# Altium schematic sheet ESM-4G-V1.1.SchDoc: =projectname
size A3; Organization: KeoLac; Address1: SIMCO Building,; Address2: 28 -  Pham Hung,; Address3: Nam Tu Liem - Ha Noi
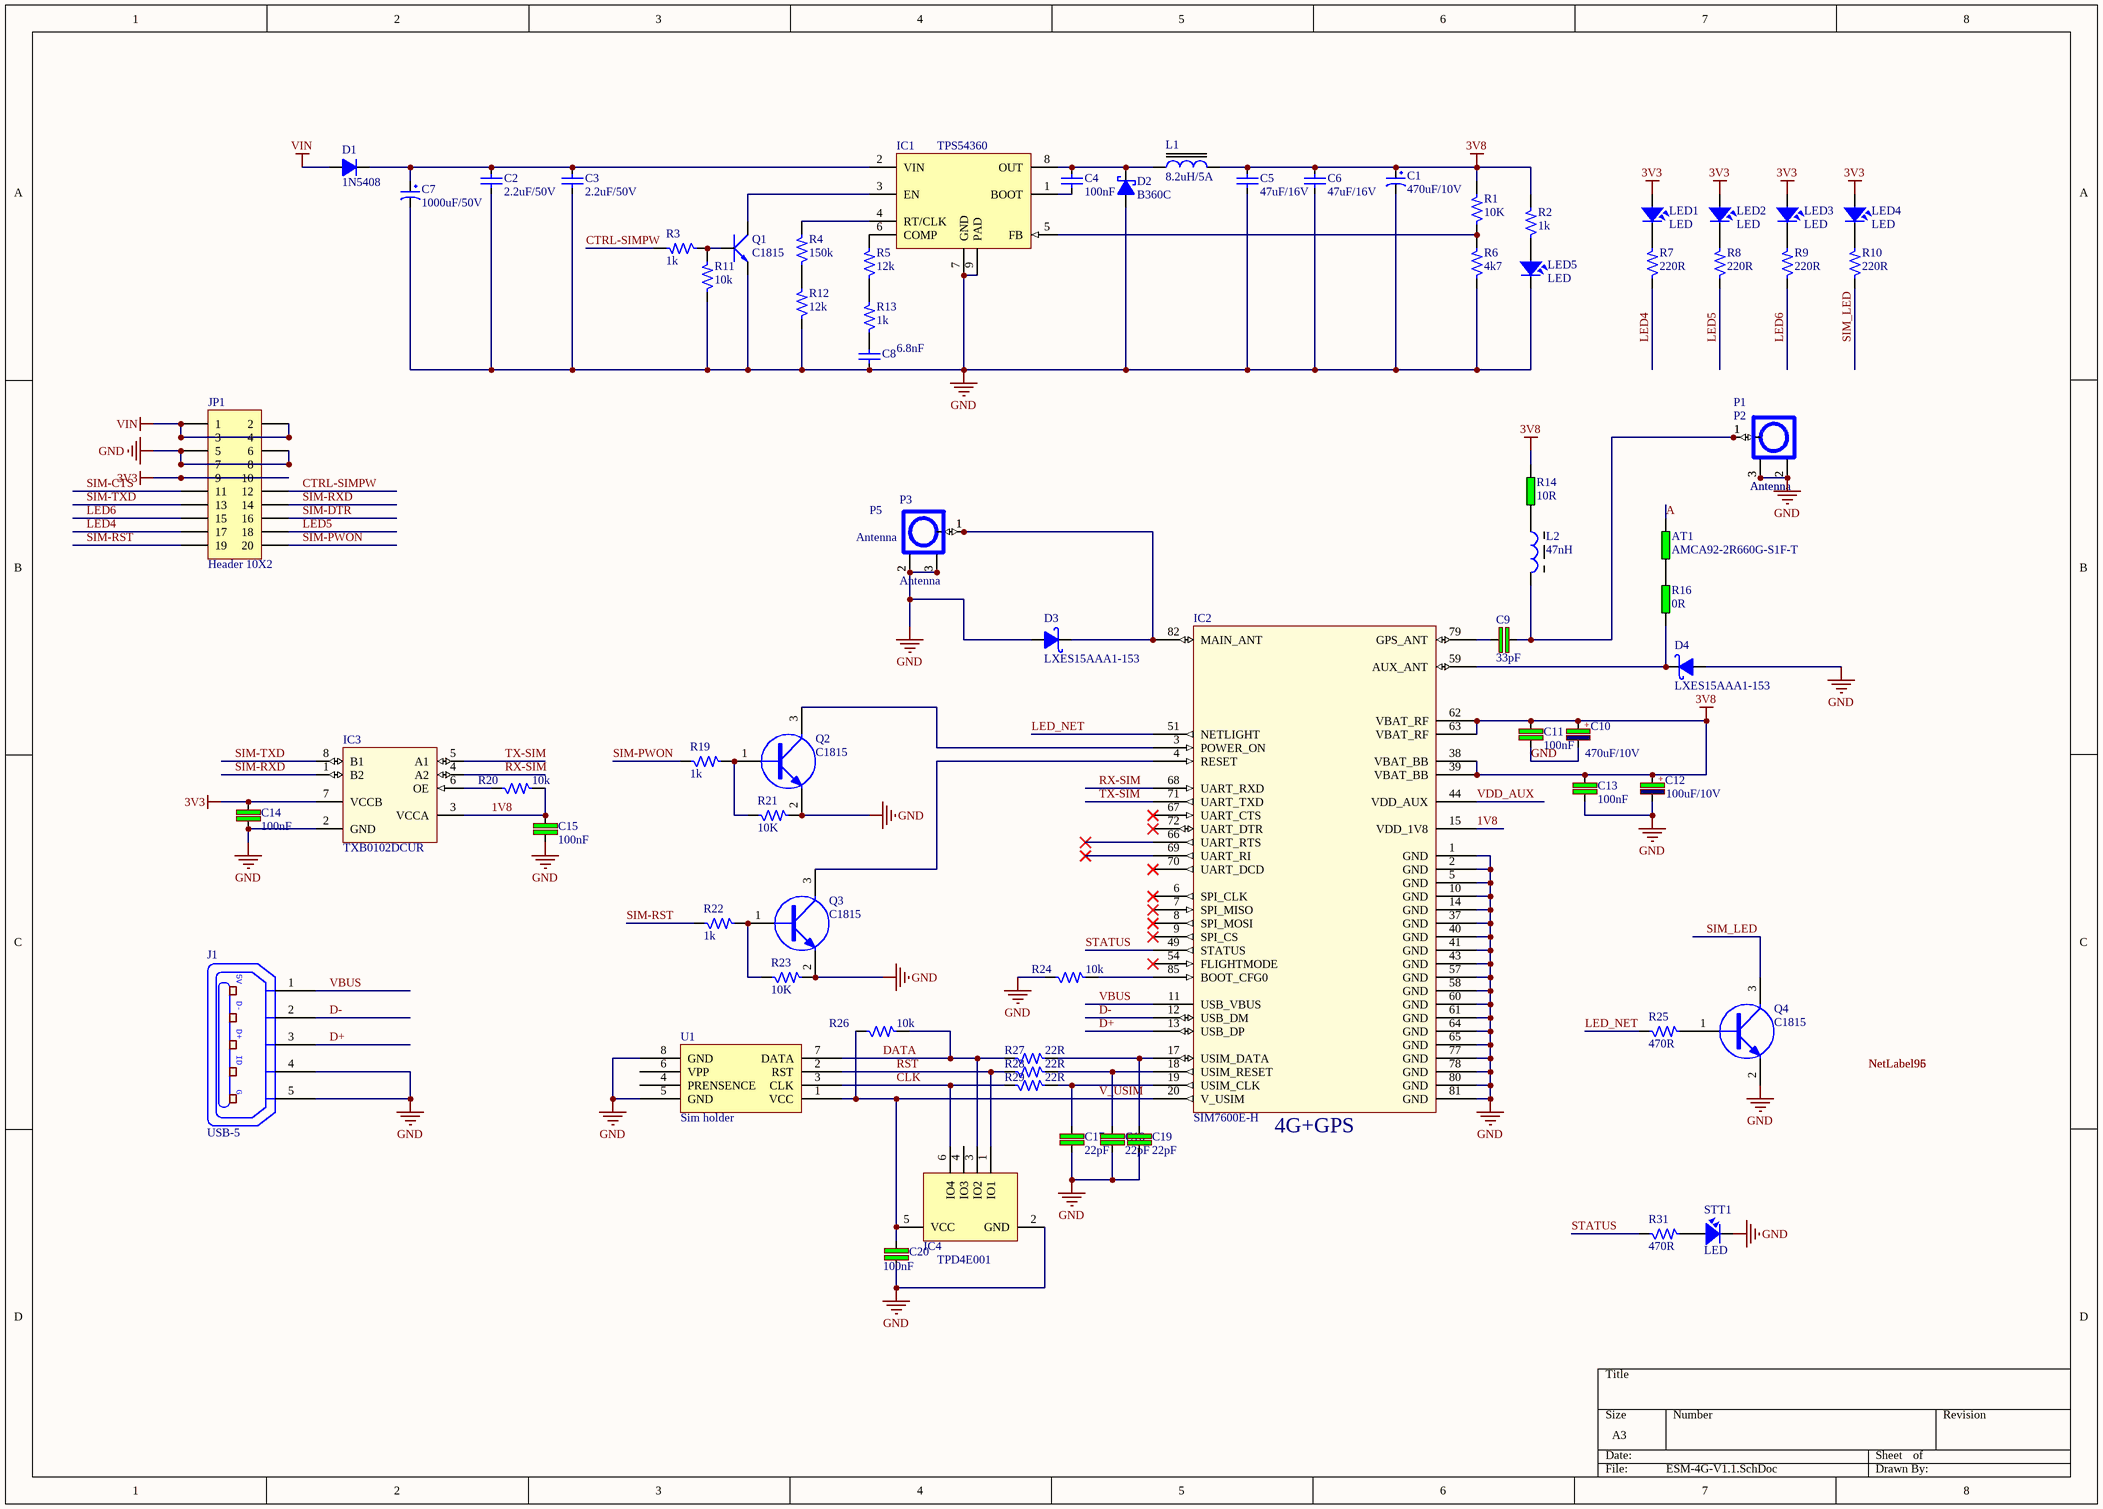
[diagram p0: ESM-4G-V1.1.SchDoc]

## Parts
AT1  AMCA92-2R660G-S1F-T  [Antena-Chip - LTE]
C1  470uF/10V  [EEFSDE]
C2  2.2uF/50V  [C-1210]
C3  2.2uF/50V  [C-1210]
C4  100nF  [C-0805]
C5  47uF/16V  [C-1210]
C6  47uF/16V  [C-1210]
C7  1000uF/50V  [CP5-10x16N]
C8  6.8nF  [C-0805]
C9  33pF  [C-0805]
C10  470uF/10V  [EEFSDE]
C11  100nF  [C-0805]
C12  100uF/10V  [EEFSDE]
C13  100nF  [C-0805]
C14  100nF  [C-0805]
C15  100nF  [C-0805]
C17  22pF  [C-0805]
C18  22pF  [C-0805]
C19  22pF  [C-0805]
C20  100nF  [C-0805]
D1  1N5408  [SMB]
D2  B360C  [SMB]
D3  LXES15AAA1-153  [R-0402]
D4  LXES15AAA1-153  [R-0402]
IC1  TPS54360  [SOIC-8 - PW]
IC2  SIM7600E-H  [SIM7600]
IC3  TXB0102DCUR  [US8]
IC4  TPD4E001  [SOT23-6 - 2]
J1  USB-5  [USB-M2]
JP1  Header 10X2  [JP10x2-FMD-2.54]
L1  8.2uH/5A  [L-L-12x12]
L2  47nH  [L-0805]
LED1  LED  [LED-5-N]
LED2  LED  [LED-5-N]
LED3  LED  [LED-5-N]
LED4  LED  [LED-5-N]
LED5  LED  [LED-0805]
P1  Antenna  [IPXS_1]
P2  Antenna  [IPXS]
P3  Antenna  [IPXS_1]
P5  Antenna  [IPXS]
Q1  C1815  [SOT23-3 Tran]
Q2  C1815  [SOT23]
Q3  C1815  [SOT23]
Q4  Name: C1815  [SOT23]  (hidden comment: C1815(MMBT4401))
R1  10K  [R-0805]
R2  1k  [R-0805]
R3  1k  [R-0805]
R4  150k  [R-0805]
R5  12k  [R-0805]
R6  4k7  [R-0805]
R7  220R  [R-0805]
R8  220R  [R-0805]
R9  220R  [R-0805]
R10  220R  [R-0805]
R11  10k  [R-0805]
R12  12k  [R-0805]
R13  1k  [R-0805]
R14  10R  [R-0805]
R16  0R  [R-0805]
R19  1k  [R-0805]
R20  10k  [R-0805]
R21  10K  [R-0805]
R22  1k  [R-0805]
R23  10K  [R-0805]
R24  10k  [R-0805]
R25  470R  [R-0805]
R26  10k  [R-0805]
R27  22R  [R-0805]
R28  22R  [R-0805]
R29  22R  [R-0805]
R31  470R  [R-0805]
STT1  LED  [LED-SMD-0805]
U1  Sim holder  [SIM_HOLDER]

## Nets
3V3: C14.1 IC3.7(VCCB) JP1.9 JP1.10 LED1.1 LED2.1 LED3.1 LED4.1
3V8: C1.1 C5.2 C6.2 C10.1 C11.1 C12.1 C13.1 IC2.38(VBAT_BB) IC2.39(VBAT_BB) IC2.62(VBAT_RF) IC2.63(VBAT_RF) L1.2 R1.2 R2.2 R14.2
GND: C1.2 C2.1 C3.1 C5.1 C6.1 C7.2 C8.1 C10.2 C11.2 C12.2 C13.2 C14.2 C15.2 C17.2 C18.2 C19.2 C20.2 D2.1(A) D3.1(A) D4.1(A) IC1.7(GND) IC1.9(PAD) IC2.1(GND) IC2.2(GND) IC2.5(GND) IC2.10(GND) IC2.14(GND) IC2.37(GND) IC2.40(GND) IC2.41(GND) IC2.43(GND) IC2.57(GND) IC2.58(GND) IC2.60(GND) IC2.61(GND) IC2.64(GND) IC2.65(GND) IC2.77(GND) IC2.78(GND) IC2.80(GND) IC2.81(GND) IC3.2(GND) IC4.2(GND) J1.4(P4) J1.5(P5) JP1.5 JP1.6 JP1.7 JP1.8 LED5.2 P1.2 P1.3 P2.2 P2.3 P3.2 P3.3 P5.2 P5.3 Q1.1(E) Q2.2(E) Q3.2(E) Q4.2(E) R6.1 R11.1 R12.1 R21.2 R23.2 R24.1 STT1.2 U1.5(GND) U1.8(GND)
VIN: D1.1(A) JP1.1 JP1.2 JP1.3 JP1.4
1V8: C15.1 IC2.15(RESERVED) IC3.3(VCCA) R20.2
A: AT1.2
CLK: IC4.6(IO4) R29.1 U1.3(CLK)
CTRL-SIMPW: JP1.12 R3.2
D+: IC2.13(USB_DP) J1.3(P3)
D-: IC2.12(USB_DM) J1.2(P2)
DATA: IC4.3(IO2) R26.2 R27.1 U1.7(DATA)
LED4: JP1.17 R7.1
LED5: JP1.18 R8.1
LED6: JP1.15 R9.1
LED_NET: IC2.51(GPIO1) R25.1
RST: IC4.1(IO1) R28.1 U1.2(RST)
RX-SIM: IC2.68(UART_RXD) IC3.4(A2)
SIM-CTS: JP1.11
SIM-DTR: JP1.16
SIM-PWON: JP1.20 R19.1
SIM-RST: JP1.19 R22.1
SIM-RXD: IC3.1(B2) JP1.14
SIM-TXD: IC3.8(B1) JP1.13
SIM_LED: Q4.3(C) R10.1
STATUS: IC2.49(GPIO40) R31.1
TX-SIM: IC2.71(UART_TXD) IC3.5(A1)
V_USIM: C20.1 IC2.20(V_USIM) IC4.5(VCC) R26.1 U1.1(VCC)
VBUS: IC2.11(USB_VBUS) J1.1(P1)
VDD_AUX: IC2.44(VDD_AUX)
NetAT1_1: AT1.1 R16.2
NetC2_2: C2.2 C3.2 C7.1 D1.2(K) IC1.2(VIN)
NetC4_1: C4.1 IC1.1(BOOT)
NetC4_2: C4.2 D2.2(K) IC1.8(OUT) L1.1
NetC8_2: C8.2 R13.1
NetC9_1: C9.1 IC2.79(GPS_ANT)
NetC9_2: C9.2 L2.2 P1.1 P2.1
NetC17_1: C17.1 IC2.19(USIM_CLK) R29.2
NetC18_1: C18.1 IC2.18(USIM_RESET) R28.2
NetC19_1: C19.1 IC2.17(USIM_DATA) R27.2
NetD3_2: D3.2(K) IC2.82(MAIN_ANT) P3.1 P5.1
NetD4_2: D4.2(K) IC2.59(AUX_ANT) R16.1
NetIC1_3: IC1.3(EN) Q1.2(C)
NetIC1_4: IC1.4(RT/CLK) R4.2
NetIC1_5: IC1.5(FB) R1.1 R6.2
NetIC1_6: IC1.6(COMP) R5.2
NetIC2_3: IC2.3(POWER_ON) Q2.3(C)
NetIC2_4: IC2.4(RESET) Q3.3(C)
NetIC2_85: IC2.85(BOOT_CFG0) R24.2
NetIC3_6: IC3.6(OE) R20.1
NetL2_1: L2.1 R14.1
NetLED1_2: LED1.2 R7.2
NetLED2_2: LED2.2 R8.2
NetLED3_2: LED3.2 R9.2
NetLED4_2: LED4.2 R10.2
NetLED5_1: LED5.1 R2.1
NetQ1_3: Q1.3(B) R3.1 R11.2
NetQ2_1: Q2.1(B) R19.2 R21.1
NetQ3_1: Q3.1(B) R22.2 R23.1
NetQ4_1: Q4.1(B) R25.2
NetR4_1: R4.1 R12.2
NetR5_1: R5.1 R13.2
NetR31_2: R31.2 STT1.1

Not connected (* = marked no-connect by the designer): IC2 6(SPI_CLK)* 7(SPI_MISO)* 8(SPI_MOSI)* 9(SPI_CS)* 16(RESERVED) 21(SPK_M) 22(SPK_P) 23(MIC1P) 24(MIC1N) 25(EAR1N) 26(EAR1P) 27(KEYSENSE_N1) 28(KEYSENSE_N0) 29(KEYPAD_0) 30(KEYPAD_2) 31(KEYSENSE_N2) 32(KEYSENSE_N3) 33(KEYPAD_1) 34(KEYPAD_4) 35(KEYPAD_3) 36(KEYSENSE_N4) 46(ADC2) 47(ADC1) 48(GPIO44) 50(GPIO43) 52(GPIO41) 53(GPIO42) 54(GPIO4) 66(UART_RTS)* 67(UART_CTS)* 69(UART_RI)* 70(UART_DCD)* 72(UART_DTR)* 73(PCM_DOUT) 74(PCM_DIN) 75(PCM_SYNC) 76(PCM_CLK); IC4 4(IO3); U1 4(PRENSENCE) 6(VPP)

## Notes on the sheet
- (near IC2) 4G+GPS
- Title
- Size:
- Date:
- A3
- Number:
- Time:
- Revision:
- Sheet
- of
- File:
- (in symbol CP4) +
- (in symbol USB-5) 5V; D-; D+; ID; G

## Library data of the parts
AT1 R14 R16 = RES: Resistor 1/4W; Value: R1/4W - 1K
C1 C7 = CP
C2 C3 = CN: part C3225X7R2A225K230AB
C4-C6 C8 = CN
C9 C11 C13-C15 C17-C20 = C: Cap SMD; Value: 103
C10 C12 = CP4: Cap 1000uF/16V - 220uF/50V; Description 5: 4,7uF>10uF/250V_3,3uF>10uF/400V - 2,2uF>4,7uF/450V; Description 1: 2200uF-3300uF/6,3V - 1000uF-2200uF/10V; Description 2: 1000uF/16V - 470uF => 1000uF/25V - 100uF/100V; Description 3: 330uF>470uF/35V_220uF>470uF/50V_10uF>22uF/250V; Description 4: 220uF => 330uF/63V - 10uF =>33uF/160 - 200V; Value: 1000uF/16V
D1 = Diode: Diode S3M 3A 1000V
D2 = Diode scotky: part: B560C-13-F
D3 D4 = 1N5822: Value: Diode c?m 1N5408
IC1 = TPS54360: TPS54360 60 V Input, 3.5 A, Step Down DC-DC Converter with Eco-mode™
IC2 = SIM7600E-H: SIM7600E-H GSM/LTE CAT4/GPS
IC3 = TXB0102DCUR: 2-BIT BIDIRECTIONAL VOLTAGE-LEVEL TRANSLATOR
J1 = USB-5: Manufacturer: FCI; Manufacturer Part Number: 10118193-0001LF; Connector Type: USB - micro B; Number of Contacts: 5; Gender: Receptacle; Specifications: USB 2.0; .Creator: MM; .Checked PCB: RF; Supplier 1: Digi-Key; RoHS: RoHS Compliant; Category: Connectors, Interconnects; Stock 1: 28642; Pricing 1: 1=0.46, 10=0.433, 25=0.3712, 50=0.3156, 100=0.3032, 250=0.27224, 500=0.25988 (USD); Packaging: Cut Tape (CT); Mounting Type: Surface Mount, Right Angle, Horizontal; Features: Shielded, Solder Retention; Ingress Protection: -; ComponentLink1URL: http://portal.fciconnect.com/Comergent//fci/drawing/10118193.pdf; ComponentLink1Description: http://portal.fciconnect.com/Comergent//fci/drawing/10118193.pdf; Supplier Part Number 1: 609-4616-1-ND; .Checked SCH: MM
JP1 = Header 10X2: Header, 10-Pin, Dual row; LatestRevisionDate: 17-Jul-2002; LatestRevisionNote: Re-released for DXP Platform.; Publisher: Altium Limited
L1 = L1: part: 7447797820
L2 = Inductor Ferit: Ferrite Beads Rated current > 1A; Value: 150 mH
P1-P3 P5 = IPXSx66: Antenna GSM GPS
Q2-Q4 = NPN: Transistor C1815, SOT23
  Q2 Q3: Name: C1815
R1-R13 R19-R24 R26-R29 = R: Resistor 1/4W
R25 R31 = R: Resistor 1/4W; Value: R1/4W - 1K
STT1 = LED: LED Single colour Green and Red; Value: LED 3 ly Single Colour
U1 = Component_1: valua: Sim holder